# Altium schematic sheet High-Level Block Diagram.SchDoc: High Level Block Diagram
size A4; DocumentNumber: 1; SheetNumber: 8; SheetTotal: 8
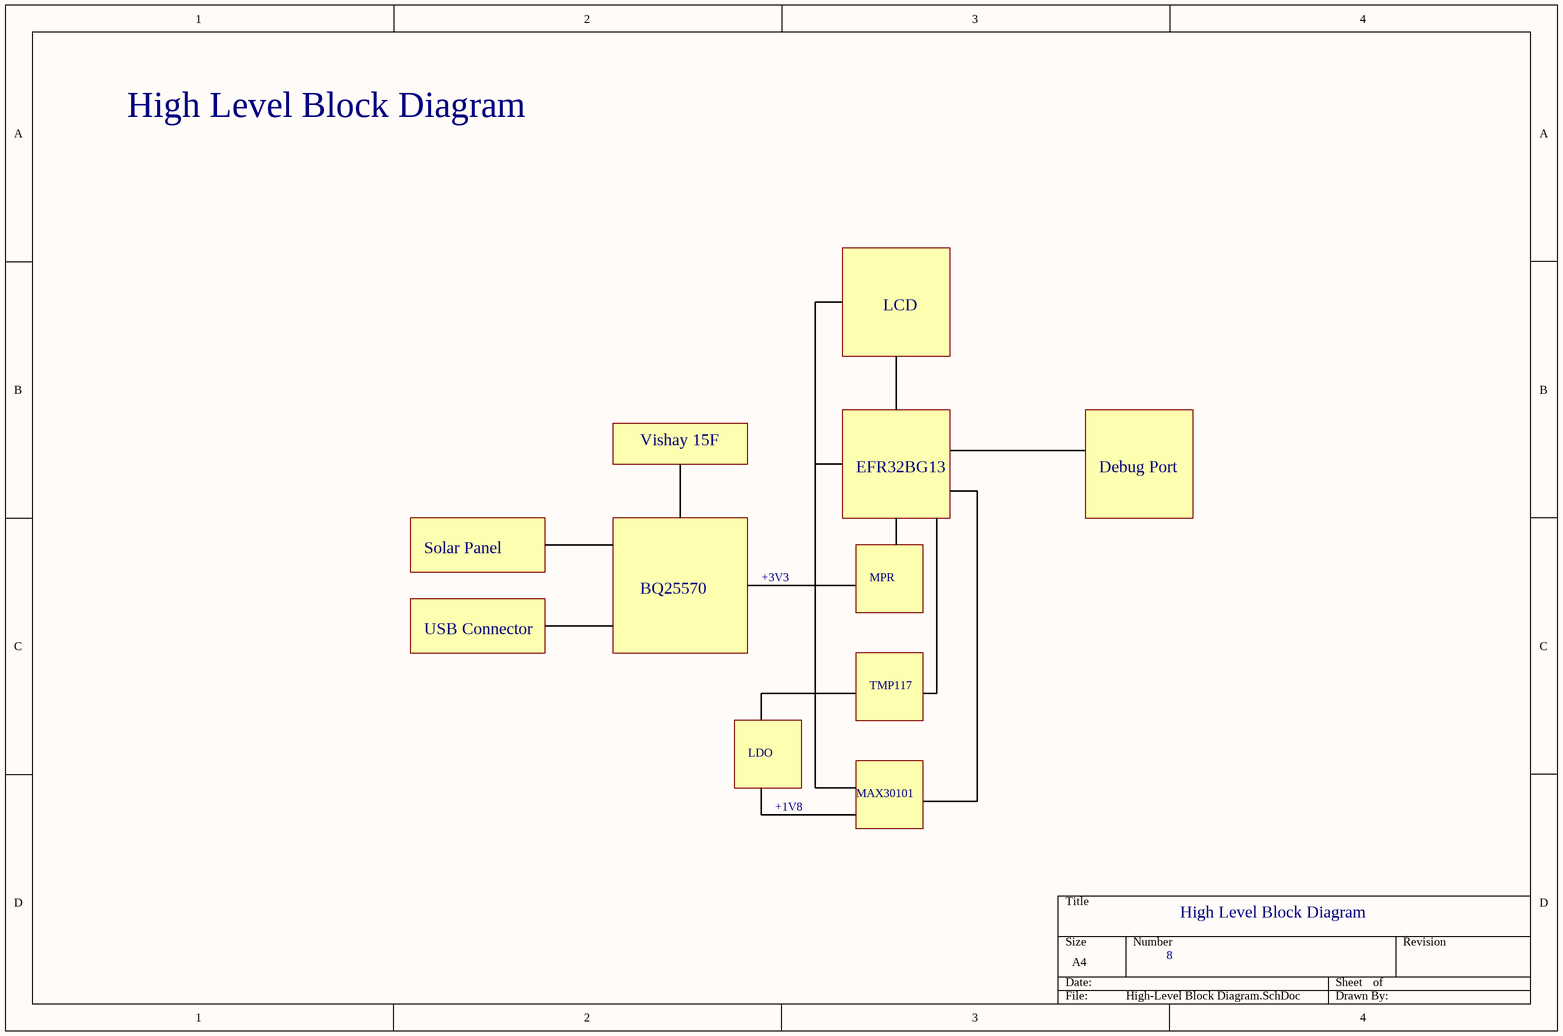
[diagram p0: High-Level Block Diagram.SchDoc]

## Notes on the sheet
- High Level Block Diagram
- LCD
- Vishay 15F
- EFR32BG13
- Debug Port
- Solar Panel
- +3V3
- MPR
- USB Connector
- BQ25570
- TMP117
- LDO
- +1V8
- MAX30101